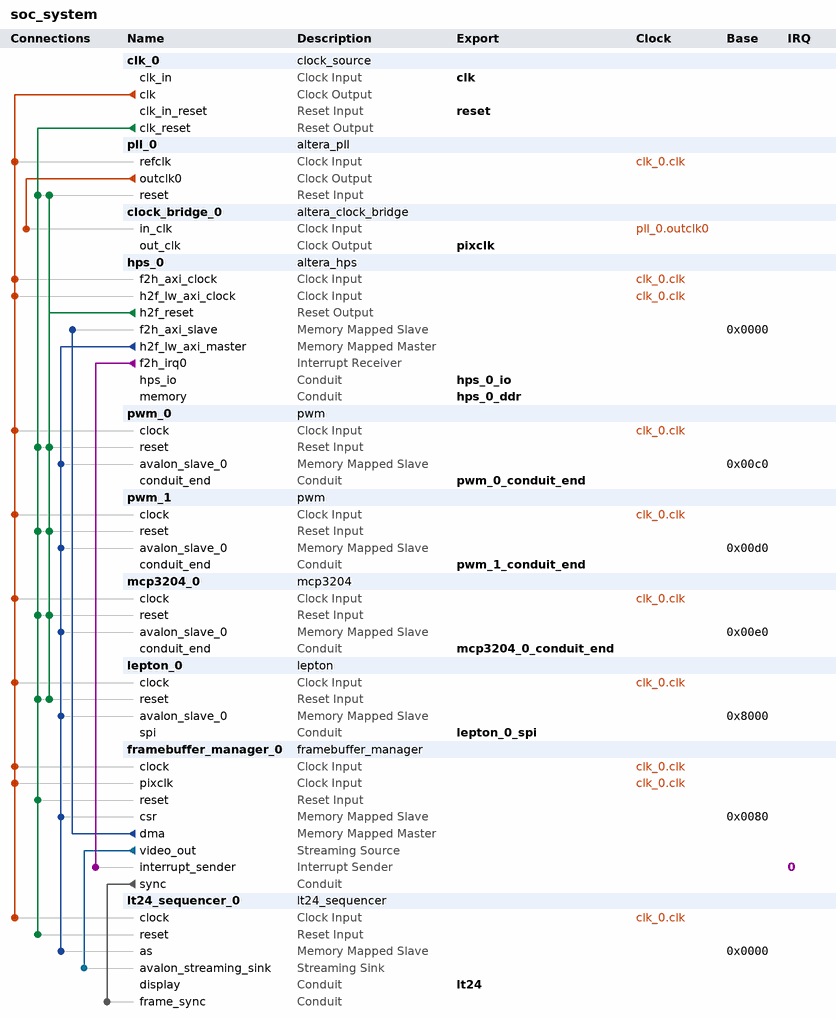
[diagram p0: system contents]
# Platform Designer (Qsys) system soc_system, Cyclone V 5CSEMA4U23C6
# Parameters at their usual value, and those the tool derives, are not listed.
package require -exact qsys 18.1
create_system soc_system
set_project_property DEVICE_FAMILY {Cyclone V}
set_project_property DEVICE 5CSEMA4U23C6

add_instance clk_0 clock_source 18.1
set_instance_parameter_value clk_0 clockFrequency 50000000

add_instance pll_0 altera_pll 18.1
set_instance_parameter_value pll_0 gui_device_speed_grade 2
set_instance_parameter_value pll_0 gui_number_of_clocks 1
set_instance_parameter_value pll_0 gui_operation_mode direct
set_instance_parameter_value pll_0 gui_output_clock_frequency0 9.0
set_instance_parameter_value pll_0 gui_pll_mode {Integer-N PLL}
set_instance_parameter_value pll_0 gui_reference_clock_frequency 50.0
set_instance_parameter_value pll_0 gui_use_locked false

add_instance clock_bridge_0 altera_clock_bridge 18.1
set_instance_parameter_value clock_bridge_0 DERIVED_CLOCK_RATE 9000000
set_instance_parameter_value clock_bridge_0 EXPLICIT_CLOCK_RATE 0

add_instance hps_0 altera_hps 18.1
set_instance_parameter_value hps_0 EMAC1_Mode RGMII
set_instance_parameter_value hps_0 EMAC1_PinMuxing {HPS I/O Set 0}
set_instance_parameter_value hps_0 F2SCLK_COLDRST_Enable false
set_instance_parameter_value hps_0 F2SCLK_DBGRST_Enable false
set_instance_parameter_value hps_0 F2SCLK_WARMRST_Enable false
set_instance_parameter_value hps_0 F2SINTERRUPT_Enable true
set_instance_parameter_value hps_0 F2S_Width 2
set_instance_parameter_value hps_0 FPGA_PERIPHERAL_OUTPUT_CLOCK_FREQ_EMAC0_GTX_CLK 125
set_instance_parameter_value hps_0 FPGA_PERIPHERAL_OUTPUT_CLOCK_FREQ_EMAC0_MD_CLK 2.5
set_instance_parameter_value hps_0 FPGA_PERIPHERAL_OUTPUT_CLOCK_FREQ_EMAC1_GTX_CLK 125
set_instance_parameter_value hps_0 FPGA_PERIPHERAL_OUTPUT_CLOCK_FREQ_EMAC1_MD_CLK 2.5
set_instance_parameter_value hps_0 HPS_PROTOCOL DDR3
set_instance_parameter_value hps_0 I2C0_Mode I2C
set_instance_parameter_value hps_0 I2C0_PinMuxing {HPS I/O Set 0}
set_instance_parameter_value hps_0 I2C1_Mode I2C
set_instance_parameter_value hps_0 I2C1_PinMuxing {HPS I/O Set 0}
set_instance_parameter_value hps_0 LWH2F_Enable true
set_instance_parameter_value hps_0 MEM_BANKADDR_WIDTH 3
set_instance_parameter_value hps_0 MEM_CLK_FREQ 400.0
set_instance_parameter_value hps_0 MEM_COL_ADDR_WIDTH 10
set_instance_parameter_value hps_0 MEM_DQ_WIDTH 32
set_instance_parameter_value hps_0 MEM_DRV_STR RZQ/6
set_instance_parameter_value hps_0 MEM_ROW_ADDR_WIDTH 15
set_instance_parameter_value hps_0 MEM_RTT_NOM RZQ/6
set_instance_parameter_value hps_0 MEM_RTT_WR {Dynamic ODT off}
set_instance_parameter_value hps_0 MEM_TCL 7
set_instance_parameter_value hps_0 MEM_TFAW_NS 37.5
set_instance_parameter_value hps_0 MEM_TRAS_NS 35.0
set_instance_parameter_value hps_0 MEM_TRCD_NS 13.75
set_instance_parameter_value hps_0 MEM_TRFC_NS 300.0
set_instance_parameter_value hps_0 MEM_TRP_NS 13.75
set_instance_parameter_value hps_0 MEM_VENDOR Other
set_instance_parameter_value hps_0 MEM_WTCL 7
set_instance_parameter_value hps_0 QSPI_Mode N/A
set_instance_parameter_value hps_0 QSPI_PinMuxing Unused
set_instance_parameter_value hps_0 REF_CLK_FREQ 25.0
set_instance_parameter_value hps_0 S2FCLK_USER2CLK 1
set_instance_parameter_value hps_0 S2F_Width 0
set_instance_parameter_value hps_0 SDIO_Mode {4-bit Data}
set_instance_parameter_value hps_0 SDIO_PinMuxing {HPS I/O Set 0}
set_instance_parameter_value hps_0 SPIM1_Mode {Single Slave Select}
set_instance_parameter_value hps_0 SPIM1_PinMuxing {HPS I/O Set 0}
set_instance_parameter_value hps_0 STM_Enable false
set_instance_parameter_value hps_0 TIMING_BOARD_AC_SKEW 0.02
set_instance_parameter_value hps_0 TIMING_BOARD_AC_TO_CK_SKEW 0.0
set_instance_parameter_value hps_0 TIMING_BOARD_DQ_TO_DQS_SKEW 0.0
set_instance_parameter_value hps_0 TIMING_BOARD_MAX_CK_DELAY 0.6
set_instance_parameter_value hps_0 TIMING_BOARD_MAX_DQS_DELAY 0.6
set_instance_parameter_value hps_0 TIMING_BOARD_SKEW_BETWEEN_DQS 0.02
set_instance_parameter_value hps_0 TIMING_BOARD_SKEW_CKDQS_DIMM_MAX 0.01
set_instance_parameter_value hps_0 TIMING_BOARD_SKEW_CKDQS_DIMM_MIN -0.01
set_instance_parameter_value hps_0 TIMING_BOARD_SKEW_WITHIN_DQS 0.02
set_instance_parameter_value hps_0 TIMING_TDH 125
set_instance_parameter_value hps_0 TIMING_TDQSCK 400
set_instance_parameter_value hps_0 TIMING_TDQSQ 120
set_instance_parameter_value hps_0 TIMING_TDS 50
set_instance_parameter_value hps_0 TIMING_TIH 250
set_instance_parameter_value hps_0 TIMING_TIS 175
set_instance_parameter_value hps_0 TIMING_TQSH 0.38
set_instance_parameter_value hps_0 UART0_Mode {No Flow Control}
set_instance_parameter_value hps_0 UART0_PinMuxing {HPS I/O Set 0}
set_instance_parameter_value hps_0 USB1_Mode SDR
set_instance_parameter_value hps_0 USB1_PinMuxing {HPS I/O Set 0}
set_instance_parameter_value hps_0 desired_cfg_clk_mhz 100.0
set_instance_parameter_value hps_0 desired_qspi_clk_mhz 400.0

add_instance pwm_0 pwm 1.0

add_instance pwm_1 pwm 1.0

add_instance mcp3204_0 mcp3204 1.0

add_instance lepton_0 lepton 1.0

add_instance framebuffer_manager_0 framebuffer_manager 1.0

add_instance lt24_sequencer_0 lt24_sequencer 1.0

# connections
add_connection clk_0.clk framebuffer_manager_0.clock clock
add_connection clk_0.clk framebuffer_manager_0.pixclk clock
add_connection clk_0.clk hps_0.f2h_axi_clock clock
add_connection clk_0.clk hps_0.h2f_lw_axi_clock clock
add_connection clk_0.clk lepton_0.clock clock
add_connection clk_0.clk lt24_sequencer_0.clock clock
add_connection clk_0.clk mcp3204_0.clock clock
add_connection clk_0.clk pll_0.refclk clock
add_connection clk_0.clk pwm_0.clock clock
add_connection clk_0.clk pwm_1.clock clock
add_connection pll_0.outclk0 clock_bridge_0.in_clk clock
add_connection clk_0.clk_reset framebuffer_manager_0.reset reset
add_connection clk_0.clk_reset lepton_0.reset reset
add_connection clk_0.clk_reset lt24_sequencer_0.reset reset
add_connection clk_0.clk_reset mcp3204_0.reset reset
add_connection clk_0.clk_reset pll_0.reset reset
add_connection clk_0.clk_reset pwm_0.reset reset
add_connection clk_0.clk_reset pwm_1.reset reset
add_connection hps_0.h2f_reset lepton_0.reset reset
add_connection hps_0.h2f_reset mcp3204_0.reset reset
add_connection hps_0.h2f_reset pll_0.reset reset
add_connection hps_0.h2f_reset pwm_0.reset reset
add_connection hps_0.h2f_reset pwm_1.reset reset
add_connection framebuffer_manager_0.dma hps_0.f2h_axi_slave avalon
set_connection_parameter_value framebuffer_manager_0.dma/hps_0.f2h_axi_slave baseAddress 0x0000
add_connection hps_0.h2f_lw_axi_master framebuffer_manager_0.csr avalon
set_connection_parameter_value hps_0.h2f_lw_axi_master/framebuffer_manager_0.csr baseAddress 0x0080
add_connection hps_0.h2f_lw_axi_master lepton_0.avalon_slave_0 avalon
set_connection_parameter_value hps_0.h2f_lw_axi_master/lepton_0.avalon_slave_0 baseAddress 0x8000
add_connection hps_0.h2f_lw_axi_master lt24_sequencer_0.as avalon
set_connection_parameter_value hps_0.h2f_lw_axi_master/lt24_sequencer_0.as baseAddress 0x0000
add_connection hps_0.h2f_lw_axi_master mcp3204_0.avalon_slave_0 avalon
set_connection_parameter_value hps_0.h2f_lw_axi_master/mcp3204_0.avalon_slave_0 baseAddress 0x00e0
add_connection hps_0.h2f_lw_axi_master pwm_0.avalon_slave_0 avalon
set_connection_parameter_value hps_0.h2f_lw_axi_master/pwm_0.avalon_slave_0 baseAddress 0x00c0
add_connection hps_0.h2f_lw_axi_master pwm_1.avalon_slave_0 avalon
set_connection_parameter_value hps_0.h2f_lw_axi_master/pwm_1.avalon_slave_0 baseAddress 0x00d0
add_connection framebuffer_manager_0.video_out lt24_sequencer_0.avalon_streaming_sink avalon_streaming
add_connection framebuffer_manager_0.sync lt24_sequencer_0.frame_sync conduit
add_connection hps_0.f2h_irq0 framebuffer_manager_0.interrupt_sender interrupt
set_connection_parameter_value hps_0.f2h_irq0/framebuffer_manager_0.interrupt_sender irqNumber 0

# exported interfaces
add_interface clk clock sink
set_interface_property clk EXPORT_OF clk_0.clk_in
add_interface hps_0_ddr conduit end
set_interface_property hps_0_ddr EXPORT_OF hps_0.memory
add_interface hps_0_io conduit end
set_interface_property hps_0_io EXPORT_OF hps_0.hps_io
add_interface lepton_0_spi conduit end
set_interface_property lepton_0_spi EXPORT_OF lepton_0.spi
add_interface lt24 conduit end
set_interface_property lt24 EXPORT_OF lt24_sequencer_0.display
add_interface mcp3204_0_conduit_end conduit end
set_interface_property mcp3204_0_conduit_end EXPORT_OF mcp3204_0.conduit_end
add_interface pixclk clock source
set_interface_property pixclk EXPORT_OF clock_bridge_0.out_clk
add_interface pwm_0_conduit_end conduit end
set_interface_property pwm_0_conduit_end EXPORT_OF pwm_0.conduit_end
add_interface pwm_1_conduit_end conduit end
set_interface_property pwm_1_conduit_end EXPORT_OF pwm_1.conduit_end
add_interface reset reset sink
set_interface_property reset EXPORT_OF clk_0.clk_in_reset

set_interconnect_requirement {$system} qsys_mm.clockCrossingAdapter HANDSHAKE
set_interconnect_requirement {$system} qsys_mm.enableEccProtection FALSE
set_interconnect_requirement {$system} qsys_mm.insertDefaultSlave FALSE
set_interconnect_requirement {$system} qsys_mm.maxAdditionalLatency 1

save_system soc_system.qsys
